# EAGLE schematic Smarttree_BMS_3.1 (EAGLE 7.3.0)
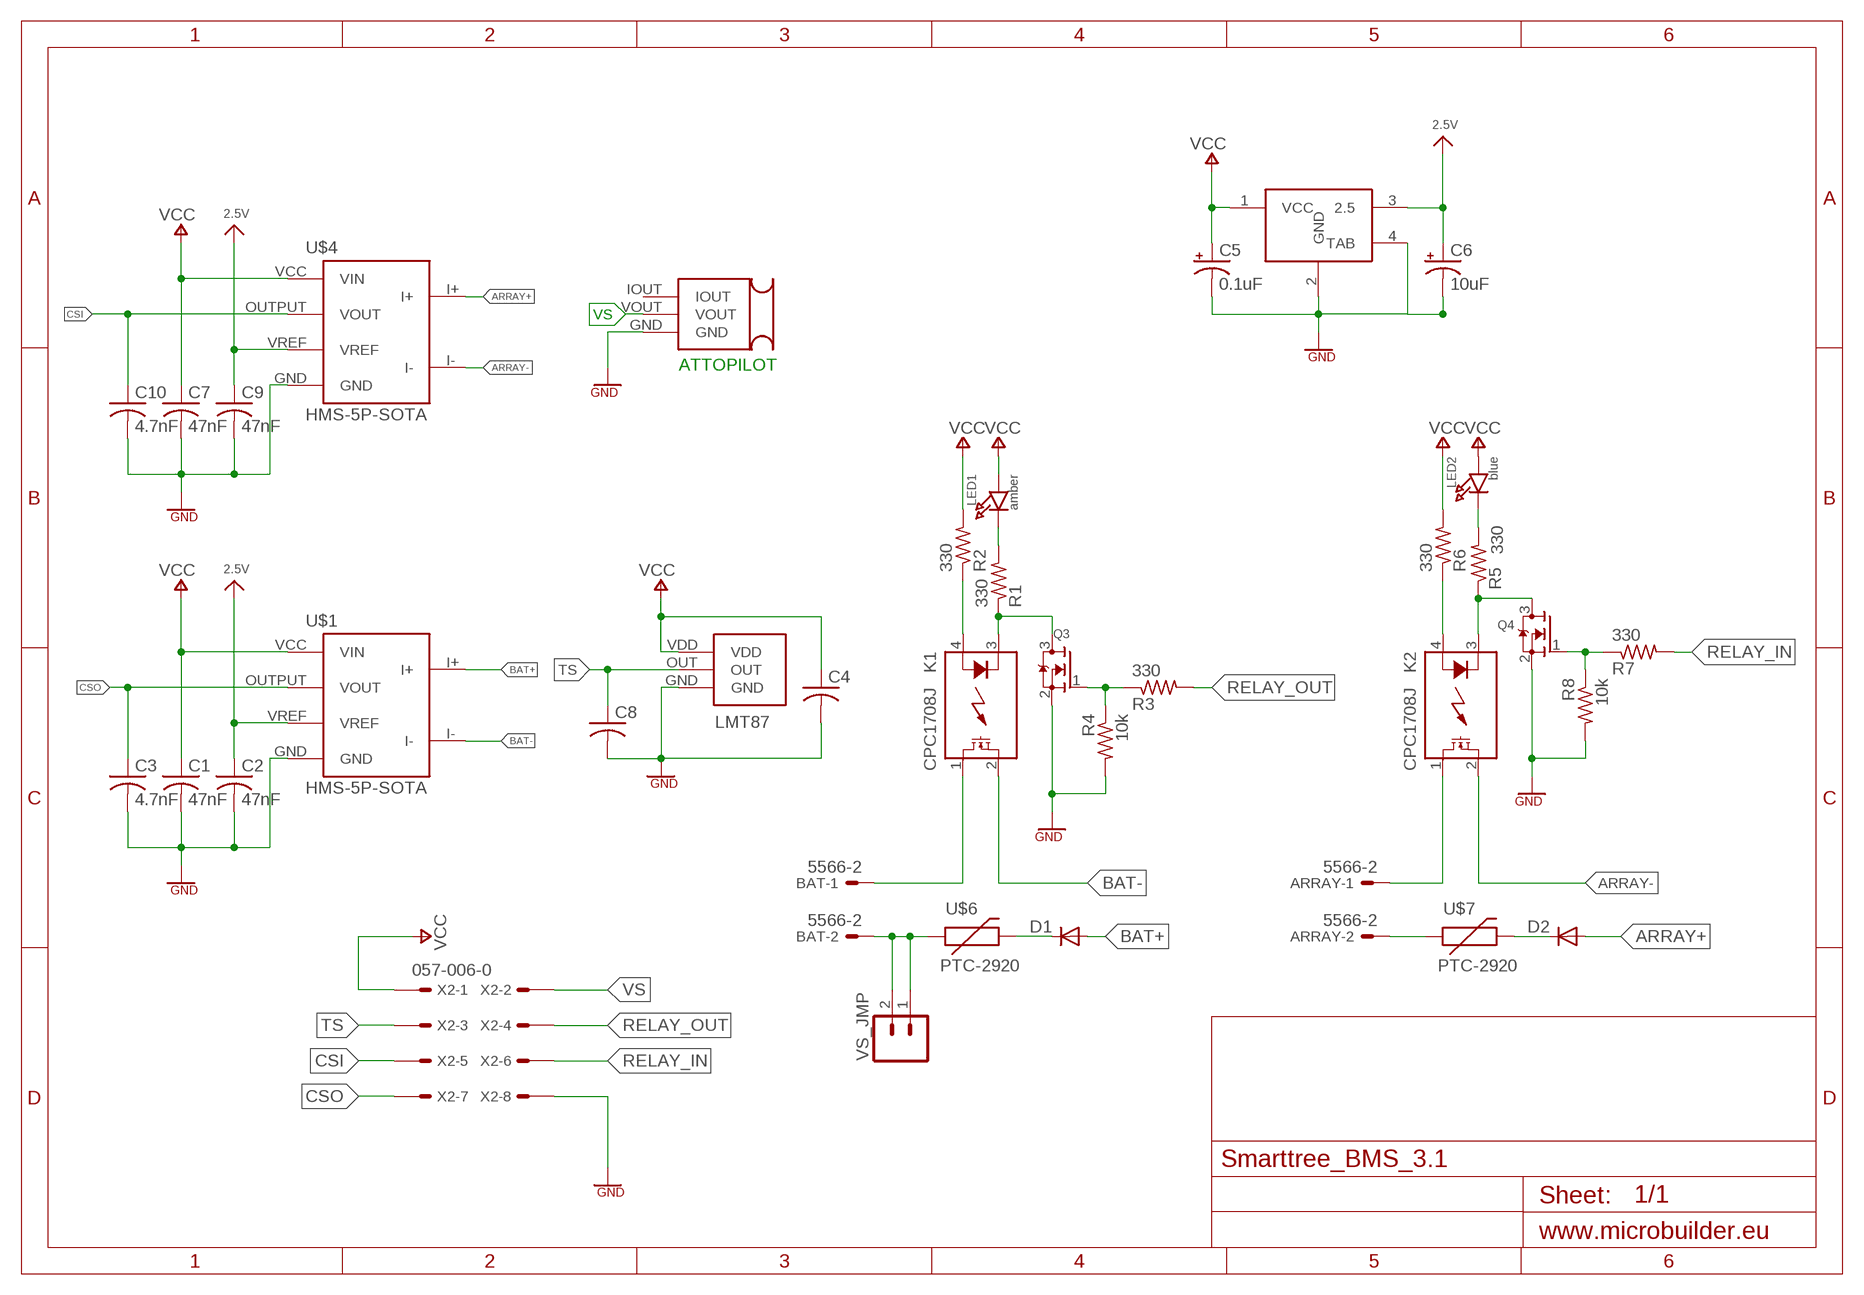
[diagram p0: schematic, sheet 1]

## Parts
ARRAY  5566-2  [5566-2]
ATTOPILOT  ATTOPILOT_VOLT  [TH_BKOT]
BAT  5566-2  [5566-2]
C1  47nF  C-USC0805  [C0805]
C2  47nF  C-USC0805  [C0805]
C3  4.7nF  C-USC0805  [C0805]
C4  C-USC0805  [C0805]
C5  0.1uF  10UF-TANT  [EIA3216]
C6  10uF  10UF-TANT  [EIA3216]
C7  47nF  C-USC0805  [C0805]
C8  C-USC0805  [C0805]
C9  47nF  C-USC0805  [C0805]
C10  4.7nF  C-USC0805  [C0805]
D1  DIODE-SOD106-R  [SOD106-R]
D2  DIODE-SOD106-R  [SOD106-R]
K1  CPC1708J  [I4-PAC]
K2  CPC1708J  [I4-PAC]
LED1  amber  LED0805  [CHIPLED_0805]
LED2  blue  LED0805  [CHIPLED_0805]
LM1117  LM2937_SOT223  [SOT223]
LMT87  LMT87_PAC  [LMT87_TO]
Q3  MOSFET-NREFLOW  [SOT23]
Q4  MOSFET-NREFLOW  [SOT23]
R1  330  R-US_R0805  [R0805]
R2  330  R-US_R0805  [R0805]
R3  330  R-US_R0805  [R0805]
R4  10k  R-US_R0805  [R0805]
R5  330  R-US_R0805  [R0805]
R6  330  R-US_R0805  [R0805]
R7  330  R-US_R0805  [R0805]
R8  10k  R-US_R0805  [R0805]
U$1  HMS-5P-SOTA  [SMD_CURR_SENSE]
U$4  HMS-5P-SOTA  [SMD_CURR_SENSE]
U$6  PTC-2920  [PTC-2920]
U$7  PTC-2920  [PTC-2920]
VS_JMP  M02  [1X02_LONGPADS]
X2  057-006-0  [057-006-0]

## Nets
2.5V: C2.1 C6.A(+) C9.1 LM1117.3(2.5) U$1.VREF U$4.VREF
ARRAY+: D2.A U$4.I+
ARRAY-: K2.2(DS2) U$4.I-
BAT+: D1.A U$1.I+
BAT-: K1.2(DS2) U$1.I-
BATIN: BAT.1 K1.1(DS1)
CSI: C10.1 U$4.OUTPUT(VOUT) X2.5
CSO: C3.1 U$1.OUTPUT(VOUT) X2.8
GND: ATTOPILOT.GND C1.2 C2.2 C3.2 C4.2 C5.C(-) C6.C(-) C7.2 C8.2 C9.2 C10.2 LM1117.2(GND) LM1117.4(TAB) LMT87.GND Q3.2(S) Q4.2(S) R4.2 R8.2 U$1.GND U$4.GND X2.7
N$1: K1.3(K) Q3.3(D) R1.1
N$2: K2.3(K) Q4.3(D) R5.1
N$3: LED1.C R1.2
N$4: K1.4(A) R2.1
N$5: LED2.C R5.2
N$6: Q3.1(G) R3.1 R4.1
N$7: K2.4(A) R6.1
N$8: Q4.1(G) R7.1 R8.1
N$9: BAT.2 U$6.1 VS_JMP.1 VS_JMP.2
N$10: D2.C U$7.2
N$11: D1.C U$6.2
N$12: ARRAY.2 U$7.1
N$13: ARRAY.1 K2.1(DS1)
RELAY_IN: R7.2 X2.6
RELAY_OUT: R3.2 X2.4
TS: C8.1 LMT87.OUT X2.3
VCC: C1.1 C4.1 C5.A(+) C7.1 LED1.A LED2.A LM1117.1(VCC) LMT87.VDD R2.2 R6.2 U$1.VCC(VIN) U$4.VCC(VIN) X2.1 ; supply symbol labelled 5V
VS: ATTOPILOT.VOUT X2.2
Unconnected: ATTOPILOT.IOUT

## Library data of the parts
ARRAY BAT = con-molex:5566-2: Mini FIT connector 2 pol Source: http://www.molex.com; OC_FARNELL: 1822072; OC_NEWARK: unknown
ATTOPILOT = Francis-Project:ATTOPILOT_VOLT
C1-C4 C7-C10 = adafruit:C-US: CAPACITOR, American symbol
C5 = SparkFun-Retired:10UF-TANT: 10uF Tantalum SMT CAP-00811- 16V 10% (EIA-3216); PROD_ID: CAP-00811; VALUE: 10uF
C6 = SparkFun-Retired:10UF-TANT: 10uF Tantalum SMT CAP-00811- 16V 10% (EIA-3216); PROD_ID: CAP-00811
D1 D2 = diode:DIODE-: DIODE
K1 K2 = relay:CPC1708J: Single-Pole, Normally Open i4-PAC (TM) DC Power Relay Source: Data sheet <http://www.clare.com/home/pdfs.nsf/www/CPC1708.pdf/$file/CPC1708.pdf>
LED1 LED2 = microbuilder:LED: LED 0603 - 0603 Surface Mount Package 2mA: Green LED - Low Power (3.9mcd, 2ma, 1.7Vf) - Digikey: 475-2709-2-ND Orange LED - Low Power (9.8mcd, 2ma, 1.8Vf) - Digikey: 475-1194-2-ND Red LED - Low Power (5mcd, 2ma, 1.8Vf) - Digikey: 475-1195-2-ND Yellow LED - Low Power (7mcd, 2ma, 1.8Vf) - Digikey: 475-1196-2-ND 5mA: Blue LED - Low Power (17mcd, 5ma, 2.9Vf) - Digikey: LNJ937W8CRACT-ND 0805 - 0805 Surface Mount Package 2mA: Red LED (8.8mcd, 2mA, 1.8Vf, Clear) - Low Power [Digikey: 475-2510-1-ND] Green LED (5mcd, 2mA, 1.8Vf, Clear) - Low Power [Digikey: 475-2730-1-ND] Yellow LED (11.3mcd, 2mA, 1.8Vf, Clear) - Low Power [Digikey: 475-2555-1-ND] 20mA: Red LED (104mcd, 20mA, Diffused) - LS R976 [Digikey: 475-1278-6-ND] Red LED (12mcd, 20mA, 2.0Vf, Clear) - APT2012EC [Digikey: 754-1128-1-ND] Green LED (15mcd, 20mA, 2.2Vf, Clear) - APT2012GC [Digikey: 754-1131-1-ND] Orange LED (160mcd, 20mA, 2.1Vf, Clear) - APT2012SECK [Digikey: 754-1130-1-ND] 1206 - 1206 Surface Mount Package Green LED (26mcd, 20mA, Diffused) - LG N971 [Digikey: 475-1407-6-ND] Red LED (15mcd, 20mA, Diffused) - LH N974 [Digikey: 475-1416-6-ND]
LM1117 = linear2:LM2937_SOT223
LMT87 = nick:LMT87_PAC
Q3 Q4 = adafruit:MOSFET-N: N-Channel Mosfet 2N7002E - 60V 260mA SOT23 [Digikey: 2N7002ET1GOSTR-ND] - REEL BSH103 - 30V 850mA SOT23 [Digikey: 568-5013-1-ND]
R1-R8 = adafruit:R-US_: RESISTOR, American symbol
U$1 U$4 = Francis-Project:HMS-5P-SOT
U$6 U$7 = SparkFun:PTC-2920
VS_JMP = SparkFun:M02: Header 2 Standard 2-pin 0.1" header. Use with straight break away headers (SKU : PRT-00116), right angle break away headers (PRT-00553), swiss pins (PRT-00743), machine pins (PRT-00117), and female headers (PRT-00115). Molex polarized connector foot print use with SKU : PRT-08233 with associated crimp pins and housings.
X2 = con-panduit:057-006-: CONNECTOR 6-pin series 057 contact pc board low profile headers

## Net classes
0 default: width 0.406 mm, clearance 0.127 mm